# Altium project PCB_Project.PrjPcb
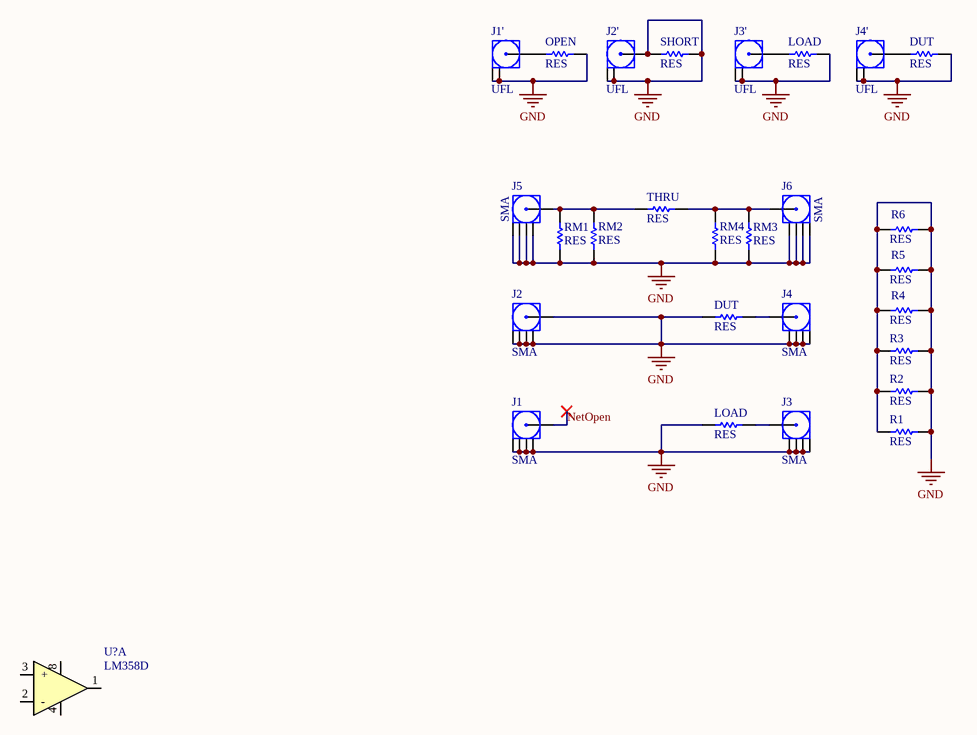
[diagram p0: Sheet1.SchDoc]
1 sheet, 28 parts. Net scope: global (net labels, ports and power ports of the same name join across sheets).
Board file: PCB1.PcbDoc

## Sheet Sheet1.SchDoc: SMD VNA Fixture
size A4; Date: *******; ApprovedBy: *******; CheckedBy: None; Author: *******; CompanyName: *******; DrawnBy: Esmaeill M; Engineer: *******; Organization: *******; Address1: *******; Address2: *******; Address3: *******; Address4: *******; Revision: *******; SheetNumber: 1; SheetTotal: 1; Address_Website: www.ioelectro.ir; Address_City: Bushehr,Iran; Company: IOElectro; ProjectNumber: 1110; Version: 0.3; CurrentTime: *******; CurrentDate: *******; Time: *******; DocumentFullPathAndName: *******; DocumentName: *******; ModifiedDate: *******; ImagePath: *******; ProjectName: *******; Application_BuildNumber: *******

### Parts
(Parts that share a designator on the sheet are numbered #1, #2 ... from top to bottom, then left to right.)
DUT#1  RES  [R-1206]
DUT#2  RES  [R-1206]
J1  SMA  [SMA_EM]
J1'  UFL  [UFL]
J2  SMA  [SMA_EM]
J2'  UFL  [UFL]
J3  SMA  [SMA_EM]
J3'  UFL  [UFL]
J4  SMA  [SMA_EM]
J4'  UFL  [UFL]
J5  SMA  [SMA_EM]
J6  SMA  [SMA_EM]
LOAD#1  RES  [R-1206]
LOAD#2  RES  [R-1206]
OPEN  RES  [R-1206]
R1  RES  [R-1206]
R2  RES  [R-1206]
R3  RES  [R-1206]
R4  RES  [R-1206]
R5  RES  [R-1206]
R6  RES  [R-1206]
RM1  RES  [R-1206]
RM2  RES  [R-1206]
RM3  RES  [R-1206]
RM4  RES  [R-1206]
SHORT  RES  [R-1206]
THRU  RES  [R-1206]
U1  LM358D  [SOIC-8]  (part A of 2)

### Nets
GND: DUT#1.2 DUT#2.1 J1.2 J1.3 J1.4 J1.5 J1'.2 J1'.3 J2.1 J2.2 J2.3 J2.4 J2.5 J2'.1 J2'.2 J2'.3 J3.2 J3.3 J3.4 J3.5 J3'.2 J3'.3 J4.2 J4.3 J4.4 J4.5 J4'.2 J4'.3 J5.2 J5.3 J5.4 J5.5 J6.2 J6.3 J6.4 J6.5 LOAD#1.2 LOAD#2.1 OPEN.2 R1.1 R1.2 R2.1 R2.2 R3.1 R3.2 R4.1 R4.2 R5.1 R5.2 R6.1 R6.2 RM1.2 RM2.1 RM3.2 RM4.1 SHORT.1 SHORT.2
NetOpen: J1.1
NetDUT#1_1: DUT#1.1 J4'.1
NetDUT#2_2: DUT#2.2 J4.1
NetJ1'_1: J1'.1 OPEN.1
NetJ3'_1: J3'.1 LOAD#1.1
NetJ3_1: J3.1 LOAD#2.2
NetJ5_1: J5.1 RM1.1 RM2.2 THRU.1
NetJ6_1: J6.1 RM3.1 RM4.2 THRU.2

Not connected (* = marked no-connect by the designer): U1 1(O1) 2(-) 3(+) 4(VDD) 8(VCC)

### Notes on the sheet
- Title:
- Size:
- Date:
- A4
- Project Number:
- Time:
- Revision:
- Sheet
- of
- Drawn By:
- IOElectro
- File:
- Note:

### Library data of the parts
J1 = SMA-CONNECTOR: Straight SMA Connector; MP: altium_native_batch; Value: *; Package: None; Availability: Unavailable; Price: None
J1' J2' J3' J4' = UFL: UFL Connector; MP: altium_native_batch; Value: *; Package: None; Availability: Unavailable; Price: None
J2-J6 = SMA: SMA Connector; MP: altium_native_batch; Value: *; Package: None; Availability: Unavailable; Price: None
U1 = LM358D: Amplifier;  Dual Operational;  +/- 16 or 32V;  0.7 mA (Typ.) Supply;  +32V;  SO-8;  0; Manufacturer: STMicroelectronics; Gain Bandwidth Product: 1.1MHz; Min Supply Voltage: 3V; Common Mode Rejection Ratio: 70dB; Max Dual Supply Voltage: 15V; Voltage Gain: 100dB; Max Supply Voltage: 30V; Min Dual Supply Voltage: 1.5V; Nominal Supply Current: 1.2mA; Number of Channels: 2; Slew Rate: 0.6V/µs; Input Offset Voltage (Vos): 7mV; Input Bias Current: 150nA; Output Current: 40mA; Operating Supply Current: 700uA; Output Current per Channel: 60mA; Amplifier Type: GENERAL PURPOSE; Dual Supply Voltage: 9V; Max Input Voltage: 28.5V; Min Input Voltage: 0V; Supplier 1: Digi-Key; Manufacturer Part Number: LM358D; RoHS: Yes; Category: Amplifiers - Op Amps, Buffer, Instrumentation; Stock 1: 36148; Pricing 1: 1=2/81000, 10=2/52300, 25=2/38480, 100=2/06700, 250=1/96100, 500=1/75960, 1000=1/75000 (USD); Mount: Surface Mount; Case/Package: SOIC; Number of Pins: 8; Weight: 0.01lb; Min Operating Temperature: 0°C; Max Operating Temperature: 70°C; Packaging: Rail/Tube; Number of Circuits: 2; Operating Supply Voltage: 15V; Package Quantity: 100; Bandwidth: 1.1MHz; Number of Elements: 2; Technology: BIPOLAR; Supply Current: 1.2mA; Unity Gain Bandwidth Product: 1.1MHz; Number of Amplifiers: 2; Series: -; Input Offset Voltage-Max: 7mV; Slew Rate-Nom: 0.6V/µs; Length: 4.9mm; Width: 3.9mm; Height: 1.25mm; Radiation Hardening: No; Lead Free: Lead Free; RoHS Compliant: Yes; REACH SVHC: No SVHC; ComponentLink1URL: https://datasheet.ciiva.com/14151/jhlm258-e-14151238.pdf?src-supplier=Distrelec; ComponentLink1Description: https://datasheet.ciiva.com/14151/jhlm258-e-14151238.pdf?src-supplier=Distrelec; ComponentLink2URL: https://datasheet.ciiva.com/27746/82-0322-27746345.pdf?src-supplier=Rapid+Electronics; ComponentLink2Description: https://datasheet.ciiva.com/27746/82-0322-27746345.pdf?src-supplier=Rapid+Electronics; ComponentLink3URL: https://datasheet.ciiva.com/15129/getdatasheetpartid-50655-15129974.pdf?src-supplier=Verical; ComponentLink3Description: https://datasheet.ciiva.com/15129/getdatasheetpartid-50655-15129974.pdf?src-supplier=Verical; ComponentLink4URL: https://datasheet.ciiva.com/29306/155598-da-01-en-op-verst-lm358d-stm-29306828.pdf?src-supplier=Conrad; ComponentLink4Description: https://datasheet.ciiva.com/29306/155598-da-01-en-op-verst-lm358d-stm-29306828.pdf?src-supplier=Conrad; ComponentLink5URL: https://datasheet.ciiva.com/14544/70013561-14544765.pdf?src-supplier=Allied+Electronics; ComponentLink5Description: https://datasheet.ciiva.com/14544/70013561-14544765.pdf?src-supplier=Allied+Electronics; ComponentLink6URL: https://datasheet.ciiva.com/16456/cd00000464-16456953.pdf?src-supplier=Future+Electronics; ComponentLink6Description: https://datasheet.ciiva.com/16456/cd00000464-16456953.pdf?src-supplier=Future+Electronics; ComponentLink7URL: https://datasheet.ciiva.com/1811/cd00000464-1811312.pdf?src-supplier=Digi-Key; ComponentLink7Description: https://datasheet.ciiva.com/1811/cd00000464-1811312.pdf?src-supplier=Digi-Key; Supplier Part Number 1: 497-18378-ND